# Altium schematic sheet MOTOR_DRIVER_DRV10866.SchDoc
size A4
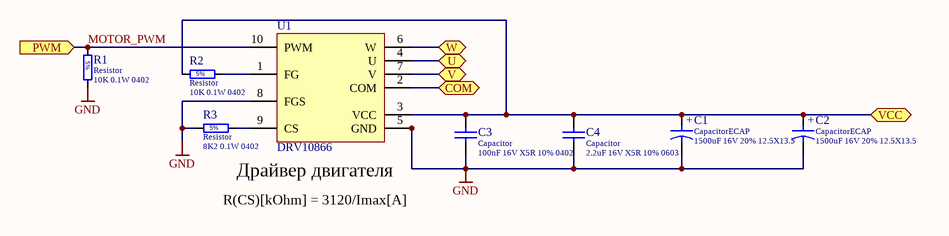
[diagram p0: MOTOR_DRIVER_DRV10866.SchDoc]

## Parts
C1  CapacitorECAP  value 1500uF 16V 20% 12.5X13.5  [12.5X13.5]
C2  CapacitorECAP  value 1500uF 16V 20% 12.5X13.5  [12.5X13.5]
C3  Capacitor  value 100nF 16V X5R 10% 0402  [0402]
C4  Capacitor  value 2.2uF 16V X5R 10% 0603  [0603]
R1  Resistor  value 10K 0.1W 0402  [0402]
R2  Resistor  value 10K 0.1W 0402  [0402]
R3  Resistor  value 8K2 0.1W 0402  [0402]
U1  DRV10866  [SON-10-0.5_3x3]

## Ports
COM, PWM (in), U, V, VCC, W

## Nets
GND: C1.2 C2.2 C3.1 C4.1 R1.2 R3.1 U1.5(GND) U1.8(FGS) U1.11(GND)
COM: U1.2(COM) ; port COM
MOTOR_PWM: R1.1 U1.10(PWM) ; port PWM
U: U1.4(U) ; port U
V: U1.7(V) ; port V
VCC: C1.1 C2.1 C3.2 C4.2 R2.1 U1.3(VCC) ; port VCC
W: U1.6(W) ; port W
NetR2_2: R2.2 U1.1(FG)
NetR3_2: R3.2 U1.9(CS)

## Notes on the sheet
- Драйвер двигателя
- R(CS)[kOhm] = 3120/Imax[A]
- (in symbol CapacitorECAP) +

## Library data of the parts
C1 C2 = CapacitorECAP: Aluminium polarized cap; Voltage: 16V; Tolerance: 20%; Capacitance: 1500uF
C3 = Capacitor ceramic: Ceramic capacitor; Voltage: 16V; Tolerance: 10%; Capacitance: 100nF; Dielectric: X5R
C4 = Capacitor ceramic: Ceramic capacitor; Voltage: 16V; Tolerance: 10%; Capacitance: 2.2uF; Dielectric: X5R
R1 R2 = Resistor: Thin Film Chip Resistor; Power: 0.1W; Tolerance: 5%; Resistance: 10K
R3 = Resistor: Thin Film Chip Resistor; Power: 0.1W; Tolerance: 5%; Resistance: 8K2
U1 = DRV10866: 5-V, 3-Phase, Sensorless BLDC Motor Driver; Supplier: http://ru.mouser.com/search/ProductDetail.aspx?qs=rlDBmY3x7k44jWu8WULIdw%3d%3d&utm_source=findchips&utm_medium=aggregator&utm_campaign=595-DRV10866DSCR&utm_term=DRV10866; Price(1): 1.93; Price(100): 1.36; Datasheet: http://www.ti.com/lit/ds/symlink/drv10866.pdf